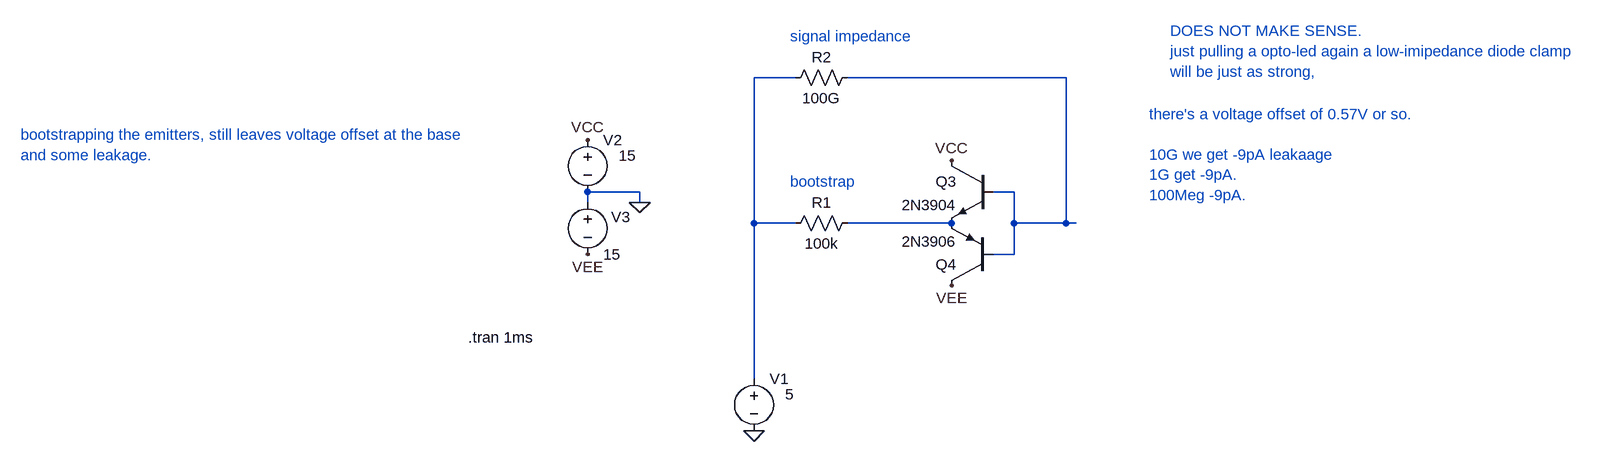
[diagram p0: schematic Draft56.asc]
Draft56.asc, the LTspice schematic file:
Version 4
SHEET 1 1904 680
WIRE 48 -96 -16 -96
WIRE 464 -96 128 -96
WIRE -192 80 -272 80
WIRE 384 80 352 80
WIRE -272 96 -272 80
WIRE -192 96 -192 80
WIRE -16 128 -16 -96
WIRE 48 128 -16 128
WIRE 288 128 128 128
WIRE 384 128 384 80
WIRE 464 128 464 -96
WIRE 464 128 384 128
WIRE 480 128 464 128
WIRE 384 176 384 128
WIRE 384 176 352 176
WIRE -16 368 -16 128
FLAG -192 96 0
FLAG -272 0 VCC
FLAG -272 176 VEE
FLAG 288 32 VCC
FLAG 288 224 VEE
FLAG -16 448 0
SYMBOL voltage -272 -16 R0
WINDOW 123 0 0 Left 0
WINDOW 39 0 0 Left 0
WINDOW 3 48 40 Left 2
SYMATTR Value 15
SYMATTR InstName V2
SYMBOL voltage -272 80 R0
WINDOW 123 0 0 Left 0
WINDOW 39 0 0 Left 0
WINDOW 0 36 39 Left 2
SYMATTR InstName V3
SYMATTR Value 15
SYMBOL npn 352 32 M0
SYMATTR InstName Q3
SYMATTR Value 2N3904
SYMBOL pnp 352 224 R180
SYMATTR InstName Q4
SYMATTR Value 2N3906
SYMBOL voltage -16 352 R0
WINDOW 123 0 0 Left 0
WINDOW 39 0 0 Left 0
WINDOW 3 48 40 Left 2
SYMATTR Value 5
SYMATTR InstName V1
SYMBOL res 144 112 R90
WINDOW 0 0 56 VBottom 2
WINDOW 3 32 56 VTop 2
SYMATTR InstName R1
SYMATTR Value 100k
SYMBOL res 144 -112 R90
WINDOW 0 0 56 VBottom 2
WINDOW 3 32 56 VTop 2
SYMATTR InstName R2
SYMATTR Value 100G
TEXT -456 304 Left 2 !.tran 1ms
TEXT -1144 -8 Left 2 ;bootstrapping the emitters, still leaves voltage offset at the base\nand some leakage.
TEXT 592 -40 Left 2 ;there's a voltage offset of 0.57V or so.\n \n10G we get -9pA leakaage\n1G get -9pA.\n100Meg -9pA.
TEXT 40 64 Left 2 ;bootstrap
TEXT 40 -160 Left 2 ;signal impedance
TEXT 624 -168 Left 2 ;DOES NOT MAKE SENSE.\njust pulling a opto-led again a low-imipedance diode clamp\nwill be just as strong,

The netlist it stands for:
* Draft56.asc
V2 VCC 0 15
V3 0 VEE 15
Q3 VCC N002 N003 0 2N3904
Q4 VEE N002 N003 0 2N3906
V1 N001 0 5
R1 N003 N001 100k
R2 N002 N001 100G
.model NPN NPN
.model PNP PNP
.lib standard.bjt
.tran 1ms
* bootstrapping the emitters, still leaves voltage offset at the base
* and some leakage.
* there's a voltage offset of 0.57V or so.
* 10G we get -9pA leakaage
* 1G get -9pA.
* 100Meg -9pA.
* bootstrap
* signal impedance
* DOES NOT MAKE SENSE.
* just pulling a opto-led again a low-imipedance diode clamp
* will be just as strong,
.backanno
.end